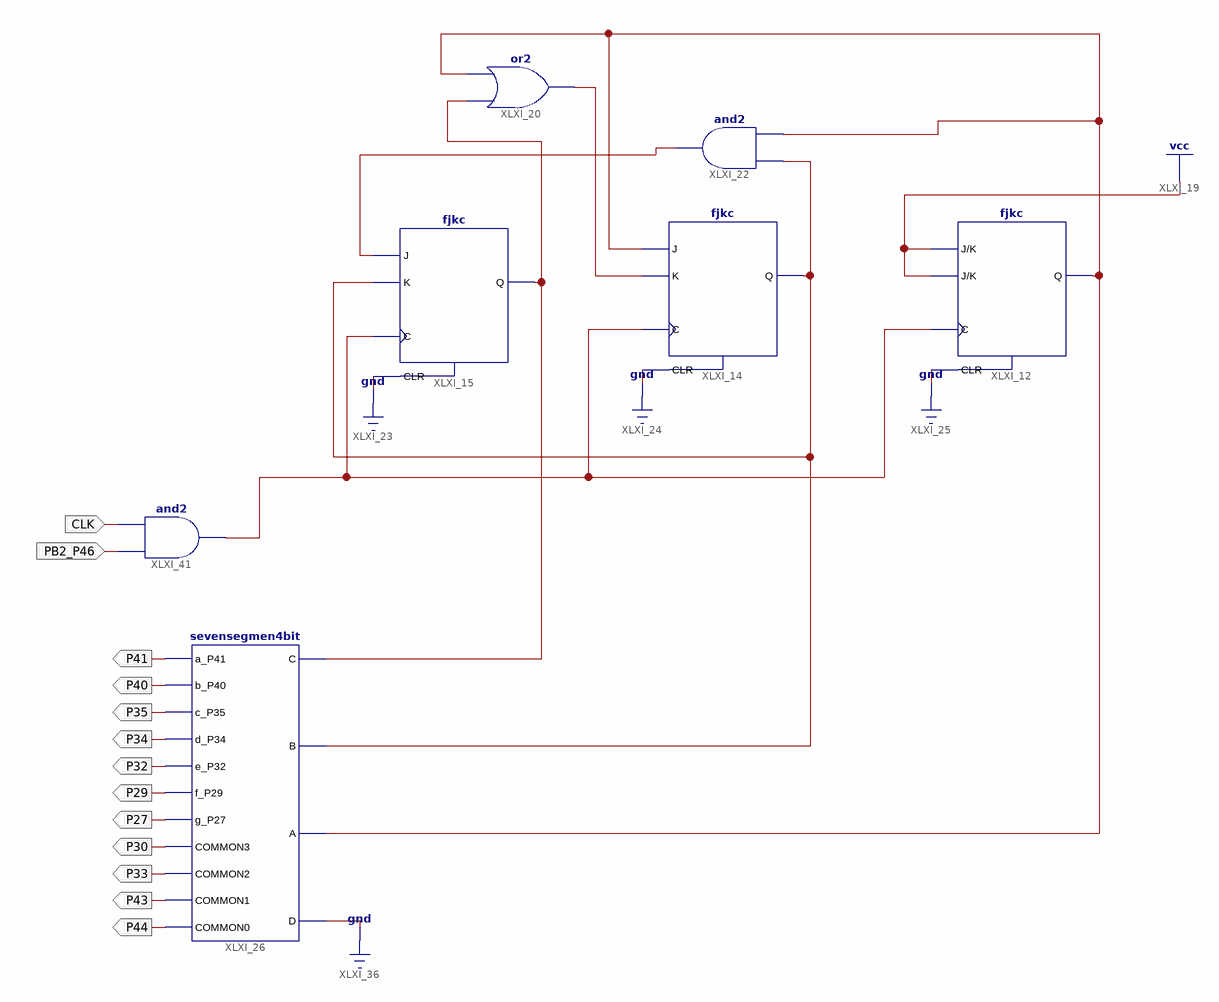
[diagram p0: schematic sheet 1]
// Xilinx ISE schematic Lab5.sch (spartan6) as structural Verilog: 7 symbols, 13 ports
module Lab5 (
  input  CLK,
  input  PB2_P46,
  output P41,
  output P40,
  output P35,
  output P34,
  output P32,
  output P29,
  output P27,
  output P30,
  output P33,
  output P43,
  output P44
);

  wire L0_P82, L1_P81, L2_P80, XLXN_27, XLXN_33;

  sevensegmen4bit XLXI_26 (
    .C(L2_P80), .B(L1_P81), .A(L0_P82), .D(1'b0), .a_P41(P41), .b_P40(P40), .c_P35(P35), .d_P34(P34),
    .e_P32(P32), .f_P29(P29), .g_P27(P27), .COMMON3(P30), .COMMON2(P33), .COMMON1(P43), .COMMON0(P44));
  fjkc XLXI_12 (.C(CLK), .CLR(1'b0), .J(1'b1), .K(1'b1), .Q(L0_P82));
  fjkc XLXI_14 (.C(CLK), .CLR(1'b0), .J(L0_P82), .K(XLXN_27), .Q(L1_P81));
  or XLXI_20 (XLXN_27, L2_P80, L0_P82);
  fjkc XLXI_15 (.C(CLK), .CLR(1'b0), .J(XLXN_33), .K(L1_P81), .Q(L2_P80));
  and XLXI_22 (XLXN_33, L1_P81, L0_P82);
  and XLXI_41 (CLK, CLK, PB2_P46);
endmodule
